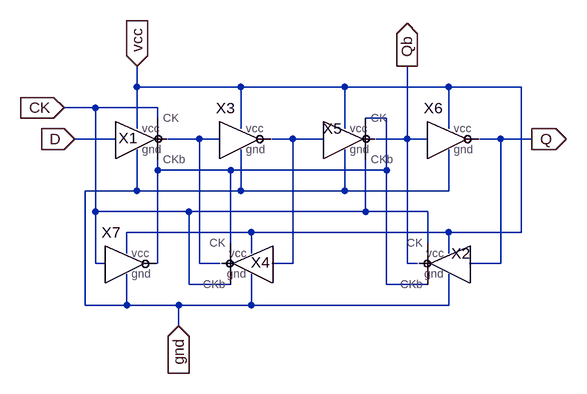
[diagram p0: schematic mydff.asc]
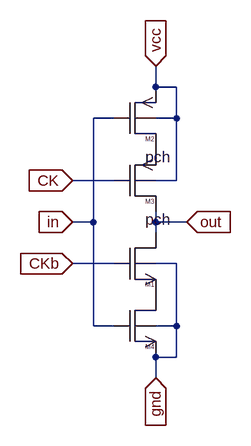
[diagram p1: sub-circuit myinv_c.asc]
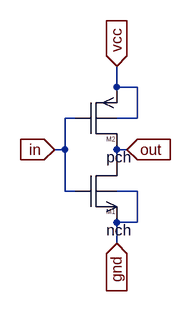
[diagram p2: sub-circuit myinv.asc]
mydff.asc, the LTspice schematic file:
Version 4
SHEET 1 880 680
WIRE 176 64 176 32
WIRE 336 64 176 64
WIRE 496 64 336 64
WIRE 656 64 496 64
WIRE 768 64 656 64
WIRE 112 96 64 96
WIRE 208 96 112 96
WIRE 208 112 208 96
WIRE 560 112 528 112
WIRE 176 128 176 64
WIRE 336 128 336 64
WIRE 496 128 496 64
WIRE 656 128 656 64
WIRE 144 144 80 144
WIRE 272 144 224 144
WIRE 304 144 272 144
WIRE 416 144 384 144
WIRE 464 144 416 144
WIRE 592 144 592 32
WIRE 592 144 544 144
WIRE 624 144 592 144
WIRE 736 144 704 144
WIRE 784 144 736 144
WIRE 208 192 208 176
WIRE 320 192 208 192
WIRE 560 192 560 112
WIRE 560 192 320 192
WIRE 176 224 176 160
WIRE 176 224 96 224
WIRE 336 224 336 160
WIRE 336 224 176 224
WIRE 496 224 496 160
WIRE 496 224 336 224
WIRE 656 224 656 160
WIRE 656 224 496 224
WIRE 112 256 112 96
WIRE 256 256 112 256
WIRE 528 256 528 176
WIRE 528 256 256 256
WIRE 624 256 528 256
WIRE 352 288 160 288
WIRE 656 288 352 288
WIRE 768 288 768 64
WIRE 768 288 656 288
WIRE 320 304 320 192
WIRE 624 304 624 256
WIRE 160 320 160 288
WIRE 352 320 352 288
WIRE 656 320 656 288
WIRE 112 336 112 256
WIRE 128 336 112 336
WIRE 208 336 208 192
WIRE 272 336 272 144
WIRE 304 336 272 336
WIRE 416 336 416 144
WIRE 416 336 384 336
WIRE 592 336 592 144
WIRE 608 336 592 336
WIRE 736 336 736 144
WIRE 736 336 688 336
WIRE 256 368 256 256
WIRE 320 368 256 368
WIRE 560 368 560 192
WIRE 624 368 560 368
WIRE 96 400 96 224
WIRE 160 400 160 352
WIRE 160 400 96 400
WIRE 240 400 160 400
WIRE 352 400 352 352
WIRE 352 400 240 400
WIRE 656 400 656 352
WIRE 656 400 352 400
WIRE 240 432 240 400
FLAG 784 144 Q
IOPIN 784 144 Out
FLAG 592 32 Qb
IOPIN 592 32 Out
FLAG 80 144 D
IOPIN 80 144 In
FLAG 64 96 CK
IOPIN 64 96 In
FLAG 176 32 vcc
IOPIN 176 32 In
FLAG 240 432 gnd
IOPIN 240 432 In
SYMBOL myinv_c 176 160 R0
WINDOW 0 -14 -2 Bottom 2
SYMATTR InstName X1
SYMBOL myinv_c 656 352 M0
SYMATTR InstName X2
SYMBOL myinv 336 160 R0
SYMATTR InstName X3
SYMBOL myinv_c 352 352 M0
WINDOW 0 -14 -2 Bottom 2
SYMATTR InstName X4
SYMBOL myinv_c 496 160 R0
SYMATTR InstName X5
SYMBOL myinv 656 160 R0
SYMATTR InstName X6
SYMBOL myinv 160 352 R0
SYMATTR InstName X7

myinv_c.asc, the sub-circuit schematic file:
Version 4
SHEET 1 880 680
WIRE 176 32 176 0
WIRE 208 32 176 32
WIRE 112 80 80 80
WIRE 208 80 208 32
WIRE 208 80 176 80
WIRE 112 176 48 176
WIRE 208 176 208 80
WIRE 208 176 176 176
WIRE 80 240 80 80
WIRE 80 240 48 240
WIRE 176 240 176 224
WIRE 224 240 176 240
WIRE 176 256 176 240
WIRE 112 304 48 304
WIRE 208 304 176 304
WIRE 80 400 80 240
WIRE 112 400 80 400
WIRE 208 400 208 304
WIRE 208 400 176 400
WIRE 208 448 208 400
WIRE 208 448 176 448
WIRE 176 480 176 448
FLAG 176 480 gnd
IOPIN 176 480 In
FLAG 176 0 vcc
IOPIN 176 0 In
FLAG 48 240 in
IOPIN 48 240 In
FLAG 224 240 out
IOPIN 224 240 In
FLAG 48 176 CK
IOPIN 48 176 In
FLAG 48 304 CKb
IOPIN 48 304 In
SYMBOL nmos4 112 304 R0
SYMATTR InstName M1
SYMATTR SpiceModel nch
SYMATTR Value2 l=2u w=6u
SYMBOL pmos4 112 80 R0
WINDOW 3 48 60 Left 2
SYMATTR InstName M2
SYMATTR Value pch
SYMATTR Value2 l=2u w=18u
SYMBOL pmos4 112 176 R0
WINDOW 3 48 60 Left 2
SYMATTR InstName M3
SYMATTR Value pch
SYMATTR Value2 l=2u w=18u
SYMBOL nmos4 112 400 R0
SYMATTR InstName M4
SYMATTR SpiceModel nch
SYMATTR Value2 l=2u w=6u

myinv.asc, the sub-circuit schematic file:
Version 4
SHEET 1 880 680
WIRE 176 32 176 0
WIRE 208 32 176 32
WIRE 112 80 96 80
WIRE 208 80 208 32
WIRE 208 80 176 80
WIRE 96 128 96 80
WIRE 96 128 80 128
WIRE 192 128 176 128
WIRE 176 144 176 128
WIRE 96 192 96 128
WIRE 112 192 96 192
WIRE 208 192 176 192
WIRE 208 240 208 192
WIRE 208 240 176 240
WIRE 176 272 176 240
FLAG 176 272 gnd
IOPIN 176 272 In
FLAG 176 0 vcc
IOPIN 176 0 In
FLAG 80 128 in
IOPIN 80 128 In
FLAG 192 128 out
IOPIN 192 128 In
SYMBOL nmos4 112 192 R0
WINDOW 3 48 60 Left 2
SYMATTR InstName M1
SYMATTR Value nch
SYMATTR Value2 l=2u w=6u
SYMBOL pmos4 112 80 R0
WINDOW 3 48 60 Left 2
SYMATTR InstName M2
SYMATTR Value pch
SYMATTR Value2 l=2u w=18u

The netlist it stands for:
* mydff.asc
XX1 gnd D N002 vcc CK N001 myinv_c
XX2 gnd Q Qb vcc CK N001 myinv_c
XX3 gnd N002 N003 vcc myinv
XX4 gnd N003 N002 vcc N001 CK myinv_c
XX5 gnd N003 Qb vcc N001 CK myinv_c
XX6 gnd Qb Q vcc myinv
XX7 gnd CK N001 vcc myinv

* block symbol definitions
.subckt myinv_c gnd in out vcc CK CKb
M1 out CKb P001 gnd nch l=2u w=6u
M2 P002 in vcc vcc pch l=2u w=18u
M3 out CK P002 vcc pch l=2u w=18u
M4 P001 in gnd gnd nch l=2u w=6u
.ends myinv_c

.subckt myinv gnd in out vcc
M1 out in gnd gnd nch l=2u w=6u
M2 out in vcc vcc pch l=2u w=18u
.ends myinv

.model NMOS NMOS
.model PMOS PMOS
.lib standard.mos
.backanno
.end